# Altium schematic sheet Pi_Cellular.SchDoc
size A; SheetNumber: 3; SheetTotal: 6
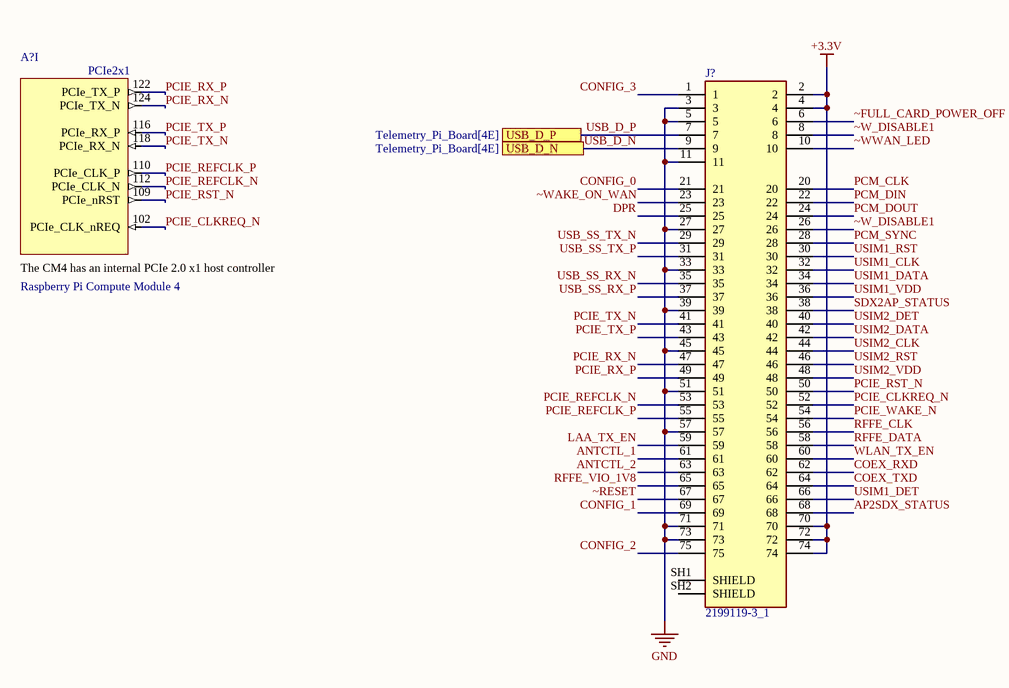
[diagram p0: Pi_Cellular.SchDoc]

## Parts
A?  Raspberry Pi Compute Module 4  [CM4-F40C-100DS-0.4v_1.5mm_0mm]  (part I of 21)  (no BOM)
J?  2199119-3_1  [TE_2199119-3]

## Ports
USB_D_N (see Telemetry_Pi_Board[4E]), USB_D_P (see Telemetry_Pi_Board[4E])

## Nets
+3.3V: J?.2 J?.4 J?.70 J?.72 J?.74
GND: J?.3 J?.5 J?.11 J?.27 J?.33 J?.39 J?.45 J?.51 J?.57 J?.71 J?.73
ANTCTL_1: J?.61
ANTCTL_2: J?.63
AP2SDX_STATUS: J?.68
COEX_RXD: J?.62
COEX_TXD: J?.64
CONFIG_0: J?.21
CONFIG_1: J?.69
CONFIG_2: J?.75
CONFIG_3: J?.1
DPR: J?.25
LAA_TX_EN: J?.59
PCIE_CLKREQ_N: A?.102(PCIe_CLK_nREQ) J?.52
PCIE_REFCLK_N: A?.112(PCIe_CLK_N) J?.53
PCIE_REFCLK_P: A?.110(PCIe_CLK_P) J?.55
PCIE_RST_N: A?.109(PCIe_nRST) J?.50
PCIE_RX_N: A?.124(PCIe_TX_N) J?.47
PCIE_RX_P: A?.122(PCIe_TX_P) J?.49
PCIE_TX_N: A?.118(PCIe_RX_N) J?.41
PCIE_TX_P: A?.116(PCIe_RX_P) J?.43
PCIE_WAKE_N: J?.54
PCM_CLK: J?.20
PCM_DIN: J?.22
PCM_DOUT: J?.24
PCM_SYNC: J?.28
RFFE_CLK: J?.56
RFFE_DATA: J?.58
RFFE_VIO_1V8: J?.65
SDX2AP_STATUS: J?.38
USB_D_N: J?.9 ; port USB_D_N
USB_D_P: J?.7 ; port USB_D_P
USB_SS_RX_N: J?.35
USB_SS_RX_P: J?.37
USB_SS_TX_N: J?.29
USB_SS_TX_P: J?.31
USIM1_CLK: J?.32
USIM1_DATA: J?.34
USIM1_DET: J?.66
USIM1_RST: J?.30
USIM1_VDD: J?.36
USIM2_CLK: J?.44
USIM2_DATA: J?.42
USIM2_DET: J?.40
USIM2_RST: J?.46
USIM2_VDD: J?.48
WLAN_TX_EN: J?.60
~FULL_CARD_POWER_OFF: J?.6
~RESET: J?.67
~W_DISABLE1: J?.8 J?.26
~WAKE_ON_WAN: J?.23
~WWAN_LED: J?.10

Not connected (* = marked no-connect by the designer): J? SH1(SHIELD) SH2(SHIELD)

## Notes on the sheet
- (in symbol CM4, part I) PCIe2x1; The CM4 has an internal PCIe 2.0 x1 host controller

## Library data of the parts
A? = CM4: Raspberry Pi Compute Module 4 by Amornthep Phunsin
J? = 2199119-3_1: Connector, Backplane, Housing, Receptacle, 67 Position, 2row; MF: TE Connectivity; Check_prices: https://www.snapeda.com/parts/2199119-3/TE+Connectivity+AMP+Connectors/view-part/?ref=eda; Value: *; MP: 2199119-3; Purchase-URL: https://pricing.snapeda.com/search/part/2199119-3/?ref=eda; SnapEDA_Link: https://www.snapeda.com/parts/2199119-3/TE+Connectivity+AMP+Connectors/view-part/?ref=snap; Package: None; Digi-Key_Part_Number: A115899TR-ND; EU_RoHS_Compliance: Compliant